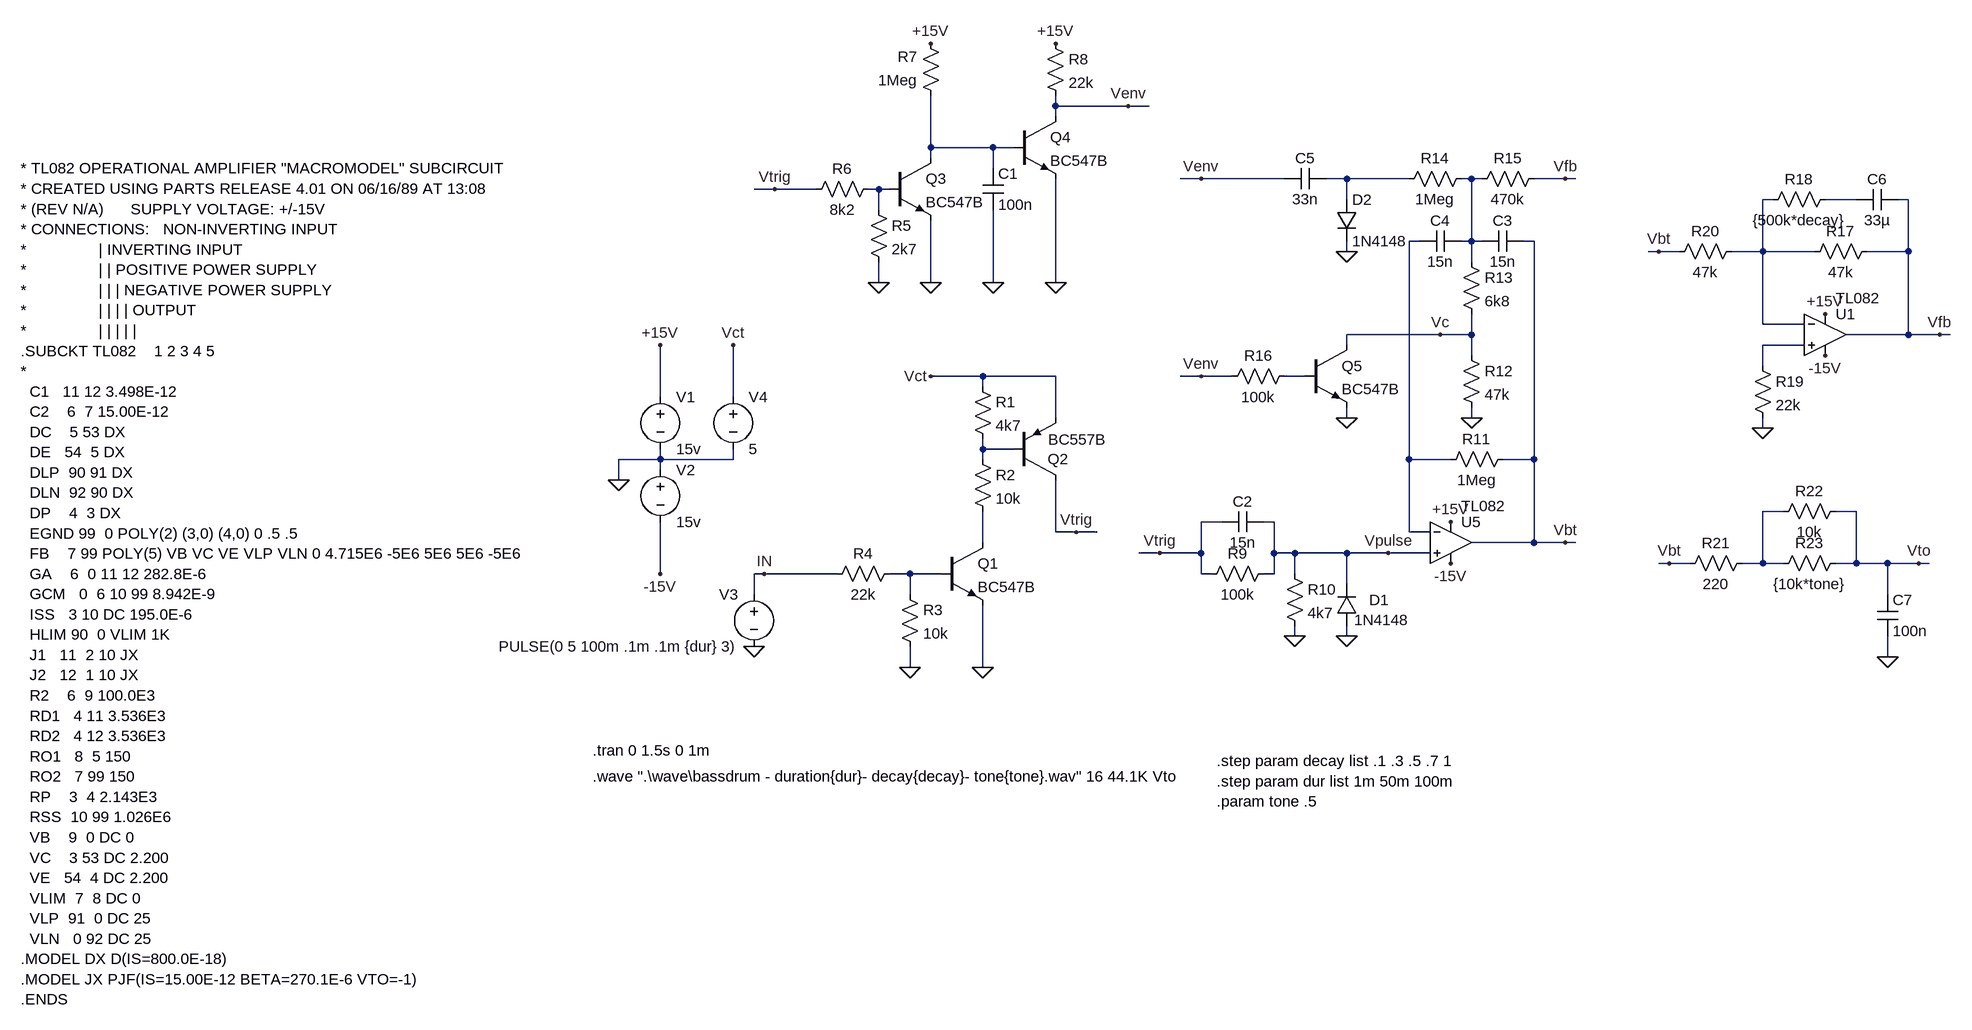
[diagram p0: schematic TR-808_BassDrum.asc]
TR-808_BassDrum.asc, the LTspice schematic file:
Version 4
SHEET 1 2688 2848
WIRE -80 -352 -80 -368
WIRE 32 -352 -80 -352
WIRE 64 -352 32 -352
WIRE -80 -336 -80 -352
WIRE -272 -288 -272 -368
WIRE -176 -288 -272 -288
WIRE -144 -288 -176 -288
WIRE -272 -272 -272 -288
WIRE -176 -256 -176 -288
WIRE 144 -240 112 -240
WIRE 272 -240 144 -240
WIRE 368 -240 336 -240
WIRE 464 -240 368 -240
WIRE 560 -240 544 -240
WIRE 576 -240 560 -240
WIRE 704 -240 656 -240
WIRE 720 -240 704 -240
WIRE -512 -224 -544 -224
WIRE -448 -224 -512 -224
WIRE -352 -224 -368 -224
WIRE -336 -224 -352 -224
WIRE 368 -208 368 -240
WIRE 1024 -208 1008 -208
WIRE 1152 -208 1104 -208
WIRE 1232 -208 1216 -208
WIRE -352 -192 -352 -224
WIRE 480 -144 464 -144
WIRE 560 -144 560 -240
WIRE 560 -144 544 -144
WIRE 576 -144 560 -144
WIRE 656 -144 640 -144
WIRE 368 -128 368 -144
WIRE 848 -128 832 -128
WIRE 880 -128 848 -128
WIRE 1008 -128 1008 -208
WIRE 1008 -128 960 -128
WIRE 1088 -128 1008 -128
WIRE 1232 -128 1232 -208
WIRE 1232 -128 1168 -128
WIRE 560 -112 560 -144
WIRE -352 -80 -352 -112
WIRE -272 -80 -272 -176
WIRE -176 -80 -176 -192
WIRE -80 -80 -80 -240
WIRE 1008 -16 1008 -128
WIRE 1072 -16 1008 -16
WIRE 512 0 368 0
WIRE 560 0 560 -32
WIRE 560 0 512 0
WIRE 1232 0 1232 -128
WIRE 1232 0 1136 0
WIRE 1280 0 1232 0
WIRE 1296 0 1280 0
WIRE 368 16 368 0
WIRE 1072 16 1008 16
WIRE 560 32 560 0
WIRE 1008 48 1008 16
WIRE -192 64 -272 64
WIRE -80 64 -192 64
WIRE 144 64 112 64
WIRE 192 64 144 64
WIRE 304 64 272 64
WIRE -192 80 -192 64
WIRE -688 96 -688 16
WIRE -576 96 -576 16
WIRE -80 128 -80 64
WIRE 368 128 368 112
WIRE 560 128 560 112
WIRE 1008 144 1008 128
WIRE -192 176 -192 160
WIRE -144 176 -192 176
WIRE -688 192 -688 176
WIRE -688 192 -752 192
WIRE -576 192 -576 176
WIRE -576 192 -688 192
WIRE -192 192 -192 176
WIRE 464 192 464 -144
WIRE 528 192 464 192
WIRE 656 192 656 -144
WIRE 656 192 608 192
WIRE -688 208 -688 192
WIRE -752 224 -752 192
WIRE 1040 272 1008 272
WIRE 1152 272 1120 272
WIRE 176 288 144 288
WIRE 256 288 240 288
WIRE -80 304 -80 224
WIRE -48 304 -80 304
WIRE -16 304 -48 304
WIRE 464 304 464 192
WIRE 496 304 464 304
WIRE -192 320 -192 272
WIRE 656 320 656 192
WIRE 656 320 560 320
WIRE 704 320 656 320
WIRE 720 320 704 320
WIRE 80 336 48 336
WIRE 144 336 144 288
WIRE 144 336 80 336
WIRE 256 336 256 288
WIRE 288 336 256 336
WIRE 368 336 288 336
WIRE 432 336 368 336
WIRE 496 336 432 336
WIRE 864 352 848 352
WIRE 896 352 864 352
WIRE 1008 352 1008 272
WIRE 1008 352 976 352
WIRE 1040 352 1008 352
WIRE 1152 352 1152 272
WIRE 1152 352 1120 352
WIRE 1200 352 1152 352
WIRE 1248 352 1200 352
WIRE 1264 352 1248 352
WIRE -688 368 -688 288
WIRE -528 368 -544 368
WIRE -416 368 -528 368
WIRE -304 368 -336 368
WIRE -256 368 -304 368
WIRE 144 368 144 336
WIRE 160 368 144 368
WIRE 256 368 256 336
WIRE 256 368 240 368
WIRE 288 368 288 336
WIRE 368 384 368 336
WIRE -544 400 -544 368
WIRE -304 400 -304 368
WIRE 1200 400 1200 352
WIRE 288 464 288 448
WIRE 368 464 368 448
WIRE 1200 496 1200 464
WIRE -304 512 -304 480
WIRE -192 512 -192 416
FLAG -752 224 0
FLAG -688 16 +15V
FLAG -688 368 -15V
FLAG -544 480 0
FLAG 528 352 -15V
FLAG 528 288 +15V
FLAG -528 368 IN
FLAG -192 512 0
FLAG -304 512 0
FLAG -272 64 Vct
FLAG -48 304 Vtrig
FLAG -272 -80 0
FLAG -176 -80 0
FLAG -80 -80 0
FLAG -352 -80 0
FLAG -272 -448 +15V
FLAG -80 -448 +15V
FLAG 32 -352 Venv
FLAG -512 -224 Vtrig
FLAG 288 464 0
FLAG 368 464 0
FLAG 80 336 Vtrig
FLAG 432 336 Vpulse
FLAG 368 128 0
FLAG 368 -128 0
FLAG 560 128 0
FLAG 144 -240 Venv
FLAG 144 64 Venv
FLAG 704 -240 Vfb
FLAG 704 320 Vbt
FLAG 512 0 Vc
FLAG 1104 32 -15V
FLAG 1104 -32 +15V
FLAG 1008 144 0
FLAG 1280 0 Vfb
FLAG 848 -128 Vbt
FLAG -576 16 Vct
FLAG 864 352 Vbt
FLAG 1200 496 0
FLAG 1248 352 Vto
SYMBOL voltage -688 80 R0
SYMATTR InstName V1
SYMATTR Value 15v
SYMBOL voltage -688 192 R0
SYMATTR InstName V2
SYMATTR Value 15v
SYMBOL voltage -544 384 M0
WINDOW 123 0 0 Left 0
WINDOW 39 0 0 Left 0
SYMATTR InstName V3
SYMATTR Value PULSE(0 5 100m .1m .1m {dur} 3)
SYMBOL npn -256 320 R0
SYMATTR InstName Q1
SYMATTR Value BC547B
SYMBOL pnp -144 224 M180
WINDOW 0 52 33 Left 2
WINDOW 3 53 63 Left 2
SYMATTR InstName Q2
SYMATTR Value BC557B
SYMBOL Opamps\\opamp2 528 256 R0
WINDOW 3 16 8 Left 2
SYMATTR Value TL082
SYMATTR InstName U5
SYMBOL diode 384 448 R180
WINDOW 0 -49 40 Left 2
WINDOW 3 -80 9 Left 2
SYMATTR InstName D1
SYMATTR Value 1N4148
SYMBOL res -208 64 R0
SYMATTR InstName R1
SYMATTR Value 4k7
SYMBOL res -208 176 R0
SYMATTR InstName R2
SYMATTR Value 10k
SYMBOL res -320 384 R0
SYMATTR InstName R3
SYMATTR Value 10k
SYMBOL res -320 352 R90
WINDOW 0 0 56 VBottom 2
WINDOW 3 32 56 VTop 2
SYMATTR InstName R4
SYMATTR Value 22k
SYMBOL npn -336 -272 R0
SYMATTR InstName Q3
SYMATTR Value BC547B
SYMBOL npn -144 -336 R0
SYMATTR InstName Q4
SYMATTR Value BC547B
SYMBOL cap -192 -256 R0
SYMATTR InstName C1
SYMATTR Value 100n
SYMBOL res -368 -208 R0
SYMATTR InstName R5
SYMATTR Value 2k7
SYMBOL res -352 -240 R90
WINDOW 0 0 56 VBottom 2
WINDOW 3 32 56 VTop 2
SYMATTR InstName R6
SYMATTR Value 8k2
SYMBOL res -256 -352 R180
WINDOW 0 36 76 Left 2
WINDOW 3 36 40 Left 2
SYMATTR InstName R7
SYMATTR Value 1Meg
SYMBOL res -96 -464 R0
SYMATTR InstName R8
SYMATTR Value 22k
SYMBOL cap 240 272 R90
WINDOW 0 0 32 VBottom 2
WINDOW 3 32 32 VTop 2
SYMATTR InstName C2
SYMATTR Value 15n
SYMBOL res 256 352 R90
WINDOW 0 0 56 VBottom 2
WINDOW 3 32 56 VTop 2
SYMATTR InstName R9
SYMATTR Value 100k
SYMBOL res 272 352 R0
SYMATTR InstName R10
SYMATTR Value 4k7
SYMBOL res 544 16 R0
SYMATTR InstName R12
SYMATTR Value 47k
SYMBOL res 544 -128 R0
SYMATTR InstName R13
SYMATTR Value 6k8
SYMBOL cap 640 -160 R90
WINDOW 0 0 32 VBottom 2
WINDOW 3 32 32 VTop 2
SYMATTR InstName C3
SYMATTR Value 15n
SYMBOL cap 544 -160 R90
WINDOW 0 0 32 VBottom 2
WINDOW 3 32 32 VTop 2
SYMATTR InstName C4
SYMATTR Value 15n
SYMBOL res 448 -224 R270
WINDOW 0 32 56 VTop 2
WINDOW 3 0 56 VBottom 2
SYMATTR InstName R14
SYMATTR Value 1Meg
SYMBOL res 672 -256 R90
WINDOW 0 0 56 VBottom 2
WINDOW 3 32 56 VTop 2
SYMATTR InstName R15
SYMATTR Value 470k
SYMBOL diode 352 -208 R0
SYMATTR InstName D2
SYMATTR Value 1N4148
SYMBOL cap 336 -256 R90
WINDOW 0 0 32 VBottom 2
WINDOW 3 32 32 VTop 2
SYMATTR InstName C5
SYMATTR Value 33n
SYMBOL res 288 48 R90
WINDOW 0 0 56 VBottom 2
WINDOW 3 32 56 VTop 2
SYMATTR InstName R16
SYMATTR Value 100k
SYMBOL npn 304 16 R0
SYMATTR InstName Q5
SYMATTR Value BC547B
SYMBOL res 512 208 R270
WINDOW 0 32 56 VTop 2
WINDOW 3 0 56 VBottom 2
SYMATTR InstName R11
SYMATTR Value 1Meg
SYMBOL Opamps\\opamp2 1104 -64 R0
WINDOW 3 16 8 Left 2
SYMATTR Value TL082
SYMATTR InstName U1
SYMBOL res 1184 -144 R90
WINDOW 0 0 56 VBottom 2
WINDOW 3 32 56 VTop 2
SYMATTR InstName R17
SYMATTR Value 47k
SYMBOL res 1120 -224 R90
WINDOW 0 0 56 VBottom 2
WINDOW 3 32 56 VTop 2
SYMATTR InstName R18
SYMATTR Value {500k*decay}
SYMBOL cap 1216 -224 R90
WINDOW 0 0 32 VBottom 2
WINDOW 3 32 32 VTop 2
SYMATTR InstName C6
SYMATTR Value 33µ
SYMBOL res 992 32 R0
SYMATTR InstName R19
SYMATTR Value 22k
SYMBOL res 976 -144 R90
WINDOW 0 0 56 VBottom 2
WINDOW 3 32 56 VTop 2
SYMATTR InstName R20
SYMATTR Value 47k
SYMBOL voltage -576 80 R0
SYMATTR InstName V4
SYMATTR Value 5
SYMBOL res 992 336 R90
WINDOW 0 0 56 VBottom 2
WINDOW 3 32 56 VTop 2
SYMATTR InstName R21
SYMATTR Value 220
SYMBOL res 1136 256 R90
WINDOW 0 0 56 VBottom 2
WINDOW 3 32 56 VTop 2
SYMATTR InstName R22
SYMATTR Value 10k
SYMBOL res 1136 336 R90
WINDOW 0 0 56 VBottom 2
WINDOW 3 32 56 VTop 2
SYMATTR InstName R23
SYMATTR Value {10k*tone}
SYMBOL cap 1184 400 R0
SYMATTR InstName C7
SYMATTR Value 100n
TEXT -1672 -256 Left 2 !* TL082 OPERATIONAL AMPLIFIER "MACROMODEL" SUBCIRCUIT\n* CREATED USING PARTS RELEASE 4.01 ON 06/16/89 AT 13:08\n* (REV N/A)      SUPPLY VOLTAGE: +/-15V\n* CONNECTIONS:   NON-INVERTING INPUT\n*                | INVERTING INPUT\n*                | | POSITIVE POWER SUPPLY\n*                | | | NEGATIVE POWER SUPPLY\n*                | | | | OUTPUT\n*                | | | | |\n.SUBCKT TL082    1 2 3 4 5\n*\n  C1   11 12 3.498E-12\n  C2    6  7 15.00E-12\n  DC    5 53 DX\n  DE   54  5 DX\n  DLP  90 91 DX\n  DLN  92 90 DX\n  DP    4  3 DX\n  EGND 99  0 POLY(2) (3,0) (4,0) 0 .5 .5\n  FB    7 99 POLY(5) VB VC VE VLP VLN 0 4.715E6 -5E6 5E6 5E6 -5E6\n  GA    6  0 11 12 282.8E-6\n  GCM   0  6 10 99 8.942E-9\n  ISS   3 10 DC 195.0E-6\n  HLIM 90  0 VLIM 1K\n  J1   11  2 10 JX\n  J2   12  1 10 JX\n  R2    6  9 100.0E3\n  RD1   4 11 3.536E3\n  RD2   4 12 3.536E3\n  RO1   8  5 150\n  RO2   7 99 150\n  RP    3  4 2.143E3\n  RSS  10 99 1.026E6\n  VB    9  0 DC 0\n  VC    3 53 DC 2.200\n  VE   54  4 DC 2.200\n  VLIM  7  8 DC 0\n  VLP  91  0 DC 25\n  VLN   0 92 DC 25\n.MODEL DX D(IS=800.0E-18)\n.MODEL JX PJF(IS=15.00E-12 BETA=270.1E-6 VTO=-1)\n.ENDS
TEXT -792 640 Left 2 !.tran 0 1.5s 0 1m
TEXT 168 656 Left 2 !.step param decay list .1 .3 .5 .7 1\n.step param dur list 1m 50m 100m\n.param tone .5
TEXT -792 680 Left 2 !.wave ".\\wave\\bassdrum - duration{dur}- decay{decay}- tone{tone}.wav" 16 44.1K Vto

The netlist it stands for:
* TR-808_BassDrum.asc
V1 +15V 0 15v
V2 0 -15V 15v
V3 IN 0 PULSE(0 5 100m .1m .1m {dur} 3)
Q1 N012 N013 0 0 BC547B
Q2 Vtrig N010 Vct 0 BC557B
XU5 Vpulse N007 +15V -15V Vbt TL082  ; pins In+ In- V+ V- OUT
D1 0 Vpulse 1N4148
R1 Vct N010 4k7
R2 N010 N012 10k
R3 N013 0 10k
R4 N013 IN 22k
Q3 N001 N004 0 0 BC547B
Q4 Venv N001 0 0 BC547B
C1 N001 0 100n
R5 N004 0 2k7
R6 N004 Vtrig 8k2
R7 N001 +15V 1Meg
R8 +15V Venv 22k
C2 Vpulse Vtrig 15n
R9 Vpulse Vtrig 100k
R10 Vpulse 0 4k7
R12 Vc 0 47k
R13 N003 Vc 6k8
C3 Vbt N003 15n
C4 N003 N007 15n
R14 N002 N003 1Meg
R15 Vfb N003 470k
D2 N002 0 1N4148
C5 N002 Venv 33n
R16 N009 Venv 100k
Q5 Vc N009 0 0 BC547B
R11 N007 Vbt 1Meg
XU1 N008 N005 +15V -15V Vfb TL082  ; pins In+ In- V+ V- OUT
R17 Vfb N005 47k
R18 N006 N005 {500k*decay}
C6 Vfb N006 33µ
R19 N008 0 22k
R20 N005 Vbt 47k
V4 Vct 0 5
R21 N011 Vbt 220
R22 Vto N011 10k
R23 Vto N011 {10k*tone}
C7 Vto 0 100n
.model D D
.lib standard.dio
.model NPN NPN
.model PNP PNP
.lib standard.bjt
* TL082 OPERATIONAL AMPLIFIER "MACROMODEL" SUBCIRCUIT
* CREATED USING PARTS RELEASE 4.01 ON 06/16/89 AT 13:08
* (REV N/A)      SUPPLY VOLTAGE: +/-15V
* CONNECTIONS:   NON-INVERTING INPUT
*                | INVERTING INPUT
*                | | POSITIVE POWER SUPPLY
*                | | | NEGATIVE POWER SUPPLY
*                | | | | OUTPUT
*                | | | | |
.SUBCKT TL082    1 2 3 4 5
*
  C1   11 12 3.498E-12
  C2    6  7 15.00E-12
  DC    5 53 DX
  DE   54  5 DX
  DLP  90 91 DX
  DLN  92 90 DX
  DP    4  3 DX
  EGND 99  0 POLY(2) (3,0) (4,0) 0 .5 .5
  FB    7 99 POLY(5) VB VC VE VLP VLN 0 4.715E6 -5E6 5E6 5E6 -5E6
  GA    6  0 11 12 282.8E-6
  GCM   0  6 10 99 8.942E-9
  ISS   3 10 DC 195.0E-6
  HLIM 90  0 VLIM 1K
  J1   11  2 10 JX
  J2   12  1 10 JX
  R2    6  9 100.0E3
  RD1   4 11 3.536E3
  RD2   4 12 3.536E3
  RO1   8  5 150
  RO2   7 99 150
  RP    3  4 2.143E3
  RSS  10 99 1.026E6
  VB    9  0 DC 0
  VC    3 53 DC 2.200
  VE   54  4 DC 2.200
  VLIM  7  8 DC 0
  VLP  91  0 DC 25
  VLN   0 92 DC 25
.MODEL DX D(IS=800.0E-18)
.MODEL JX PJF(IS=15.00E-12 BETA=270.1E-6 VTO=-1)
.ENDS
.tran 0 1.5s 0 1m
.step param decay list .1 .3 .5 .7 1
.step param dur list 1m 50m 100m
.param tone .5
.wave ".\wave\bassdrum - duration{dur}- decay{decay}- tone{tone}.wav" 16 44.1K Vto
.backanno
.end